# Altium schematic sheet Shutdown_Circuit.SchDoc
size A4; SheetNumber: 9; SheetTotal: 11
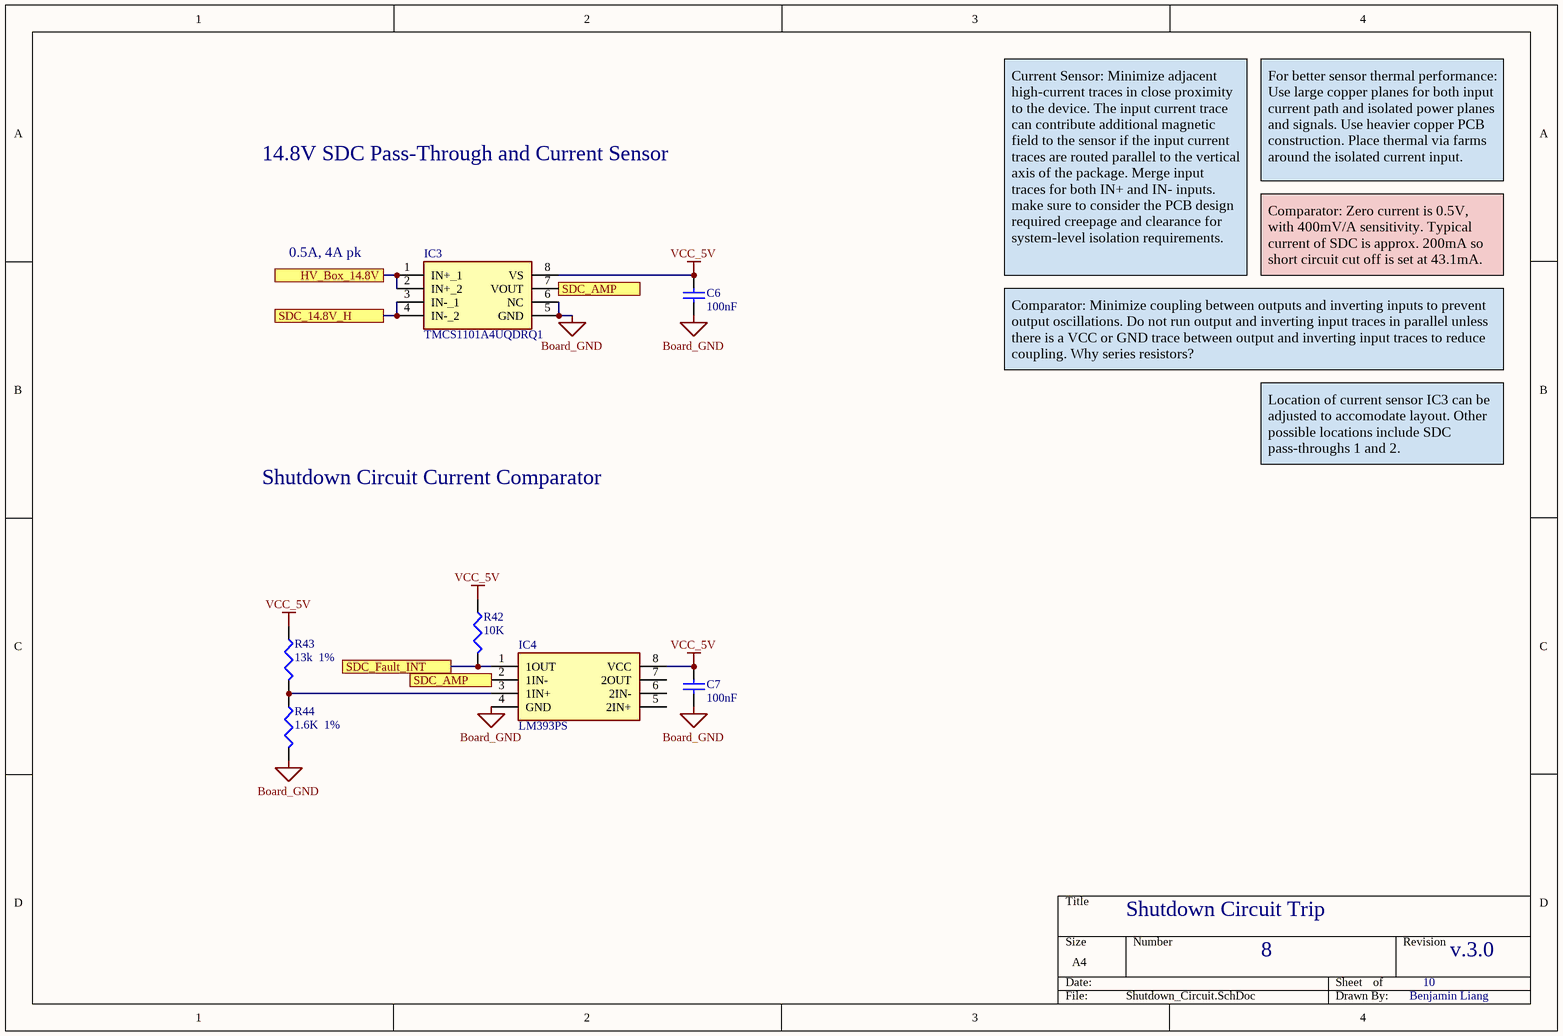
[diagram p0: Shutdown_Circuit.SchDoc]

## Parts
C6  100nF  [C1206]
C7  100nF  [C1206]
IC3  TMCS1101A4UQDRQ1  [SOIC127P600X175-8N]
IC4  LM393PS  [SOIC127P780X200-8N]
R42  10K  [J1-0603]
R43  13k  1%  [J1-0603]
R44  1.6K  1%  [J1-0603]

## Ports
HV_Box_14.8V, SDC_14.8V_H, SDC_AMP, SDC_Fault_INT

## Nets
Board_GND: C6.2 C7.2 IC3.5(GND) IC3.6(NC) IC4.4(GND) R44.2
VCC_5V: C6.1 C7.1 IC3.8(VS) IC4.8(VCC) R42.1 R43.1
HV_Box_14.8V: IC3.1(IN+_1) IC3.2(IN+_2) ; port HV_Box_14.8V
SDC_14.8V_H: IC3.3(IN-_1) IC3.4(IN-_2) ; port SDC_14.8V_H
SDC_AMP: IC3.7(VOUT) IC4.2(1IN-) ; port SDC_AMP
SDC_Fault_INT: IC4.1(1OUT) R42.2 ; port SDC_Fault_INT
NetIC4_3: IC4.3(1IN+) R43.2 R44.1

Not connected (* = marked no-connect by the designer): IC4 5(2IN+) 6(2IN-) 7(2OUT)

## Notes on the sheet
- 14.8V SDC Pass-Through and Current Sensor
- For better sensor thermal performance:        Use large copper planes for both input current path and isolated power planes and signals. Use heavier copper PCB construction. Place thermal via farms around the isolated current input.
- 0.5A, 4A pk
- Current Sensor: Minimize adjacent high-current traces in close proximity to the device. The input current trace can contribute additional magnetic field to the sensor if the input current traces are routed parallel to the vertical axis of the package. Merge input traces for both IN+ and IN- inputs. make sure to consider the PCB design required creepage and clearance for system-level isolation requirements.
- Comparator: Zero current is 0.5V, with 400mV/A sensitivity. Typical current of SDC is approx. 200mA so short circuit cut off is set at 43.1mA.
- Comparator: Minimize coupling between outputs and inverting inputs to prevent output oscillations. Do not run output and inverting input traces in parallel unless there is a VCC or GND trace between output and inverting input traces to reduce coupling. Why series resistors?
- Shutdown Circuit Current Comparator
- Location of current sensor IC3 can be adjusted to accomodate layout. Other possible locations include SDC pass-throughs 1 and 2.
- Shutdown Circuit Trip
- 8
- 10
- v.3.0
- Benjamin Liang

## Library data of the parts
C6 C7 = Cap Semi: Capacitor (Semiconductor SIM Model); Published: 8-Jun-2000; LatestRevisionDate: 29-May-2009; LatestRevisionNote: IPC-7351 Footprint Added.; PackageReference: C1206; Publisher: Altium Limited; PackageDescription: Chip Capacitor; Value: 100nF
IC3 = TMCS1101A4UQDRQ1: Integrated Circuit; Manufacturer_Name: Texas Instruments; Datasheet Link: https://www.ti.com/lit/ds/symlink/tmcs1101-q1.pdf?HQS=dis-dk-null-digikeymode-dsf-pf-null-wwe&ts=1639364451794; Height: 1.75mm; Manufacturer_Part_Number: TMCS1101A4UQDRQ1; Mouser Part Number: 595-TMCS1101A4UQDRQ1; Mouser Price/Stock: https://www.mouser.co.uk/ProductDetail/Texas-Instruments/TMCS1101A4UQDRQ1?qs=QNEnbhJQKvYtWCVWgIciDg%3D%3D; Arrow Part Number: TMCS1101A4UQDRQ1; Arrow Price/Stock: https://www.arrow.com/en/products/tmcs1101a4uqdrq1/texas-instruments?region=nac
IC4 = LM393PS: Integrated Circuit; Manufacturer_Name: Texas Instruments; Datasheet Link: https://www.ti.com/lit/gpn/LM393; Height: 2mm; Manufacturer_Part_Number: LM393PS; Arrow Part Number: LM393PS; Arrow Price/Stock: https://www.arrow.com/en/products/lm393ps/texas-instruments
R42-R44 = Res3: Resistor; Value: 220; Published: 8-Jun-2000; LatestRevisionDate: 29-May-2009; LatestRevisionNote: IPC-7351 Footprint Added.; PackageReference: J1-0603; Publisher: Altium Limited; PackageDescription: Chip Resistor